# EAGLE design Dimmer_Board_Rev_0.2 (EAGLE 8.4.1)
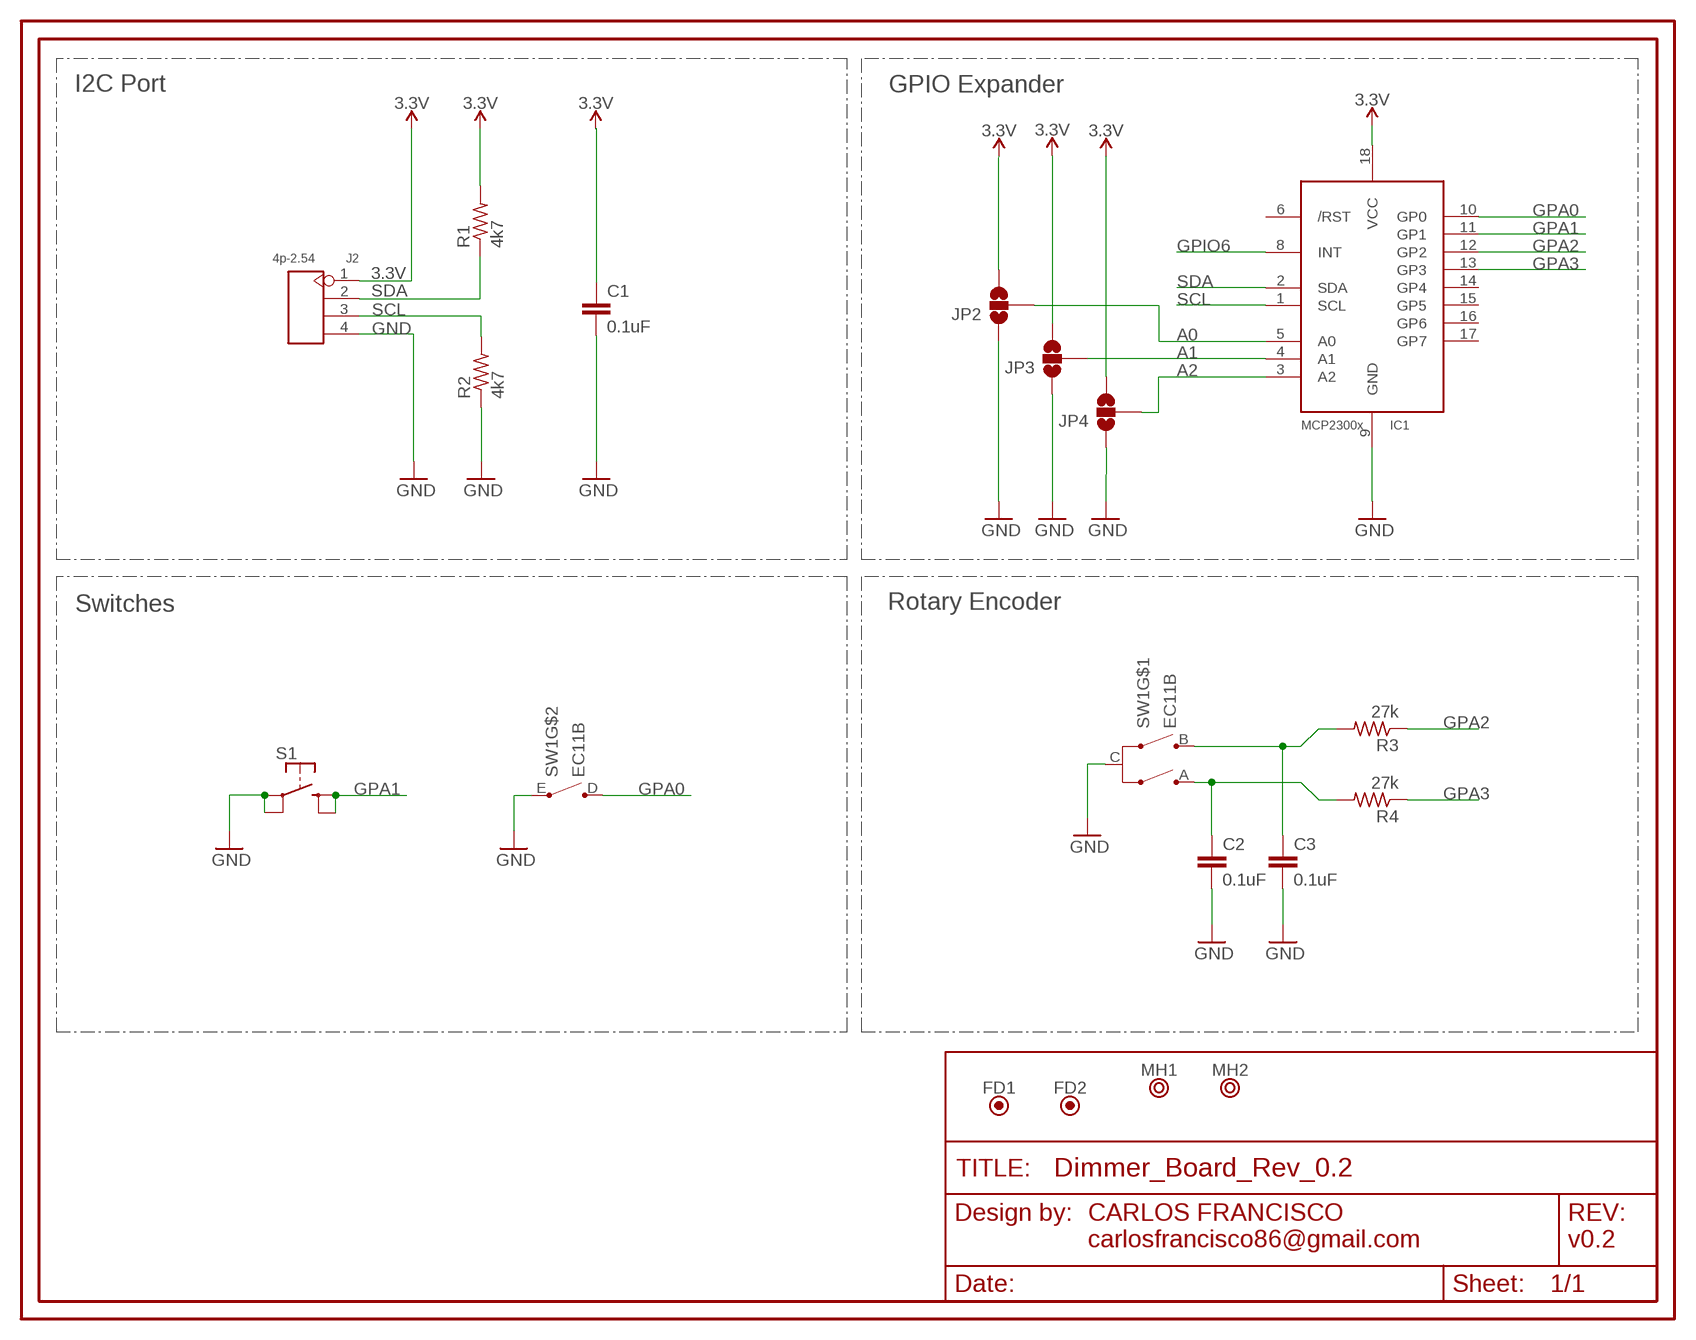
[diagram p0: schematic, sheet 1]

## Parts
C1  0.1uF  C-EUC0805  [C0805]
C2  0.1uF  C-EUC0805  [C0805]
C3  0.1uF  C-EUC0805  [C0805]
FD1  FIDUCIALBFID  [BOARD_FIDUCIAL]
FD2  FIDUCIALBFID  [BOARD_FIDUCIAL]
IC1  MCP23008/SO  [SO18W]
J2  4p-2.54  DIP-BLACK-MALE-HEADER-VERT(4P-2.54)  [H4-2.54]
JP2  JUMPER-SMT_3_NO_SILK  [SMT-JUMPER_3_NO_SILK]
JP3  JUMPER-SMT_3_NO_SILK  [SMT-JUMPER_3_NO_SILK]
JP4  JUMPER-SMT_3_NO_SILK  [SMT-JUMPER_3_NO_SILK]
MH1  MOUNTING_HOLE3.5MM  [MTGP500H350]
MH2  MOUNTING_HOLE3.5MM  [MTGP500H350]
R1  4k7  R-US_R0805  [R0805]
R2  4k7  R-US_R0805  [R0805]
R3  27k  R-US_R0805  [R0805]
R4  27k  R-US_R0805  [R0805]
S1  BUTTON-4KSC  [KSC_X]
SW1  EC11B  EC11B-V-T  [EC11B-V]

## Nets
3.3V: C1.1 IC1.18(VCC) J2.1 JP2.3 JP3.3 JP4.3 R1.2
A: C2.1 R4.2 SW1.A
A0: IC1.5(A0) JP2.2
A1: IC1.4(A1) JP3.2
A2: IC1.3(A2) JP4.2
B: C3.1 R3.2 SW1.B
GND: C1.2 C2.2 C3.2 IC1.9(GND) J2.4 JP2.1 JP3.1 JP4.1 R2.1 S1.1 S1.2 SW1.C SW1.E
GPA0: IC1.10(GP0) SW1.D
GPA1: IC1.11(GP1) S1.3 S1.4
GPA2: IC1.12(GP2) R3.1
GPA3: IC1.13(GP3) R4.1
GPIO6: IC1.8(INT)
SCL: IC1.1(SCL) J2.3 R2.2
SDA: IC1.2(SDA) J2.2 R1.1
Unconnected: IC1.6(/RST) IC1.14(GP4) IC1.15(GP5) IC1.16(GP6) IC1.17(GP7) MH1.1 MH2.1

## Notes on the sheet
- I2C Port | GPIO Expander
- Switches | Rotary Encoder
- CARLOS FRANCISCO
  carlosfrancisco86@gmail.com
- v0.2

## Library data of the parts
C1-C3 = rcl:C-EU: CAPACITOR, European symbol
FD1 FD2 = Mtronik-Aesthetics:FIDUCIAL: FIDUCIAL Symbol
IC1 = adafruit:MCP23008: MCP23008 Inexpensive i2c i/o expander - 8 general purpose i/o pins with optional pullups
J2 = Seeed-Connector:DIP-BLACK-MALE-HEADER-VERT(4P-2.54): 320020017; MPN: P125-1104A0BS116A1
JP2-JP4 = SparkFun-Jumpers:JUMPER-SMT_3_NO: Normally open jumper This jumper has three pads in close proximity to each other. Apply solder to close the connection(s).
MH1 MH2 = Mtronik-Aesthetics:MOUNTING_HOLE: MOUNTING HOLE Symbol
R1-R4 = rcl:R-US_: RESISTOR, American symbol
S1 = CoachManAir:BUTTON-4
SW1 = alps:EC11B-V-T: ALPS EC11B Vertikal mit Taster Drehimpulsgeber 11mm

## Board
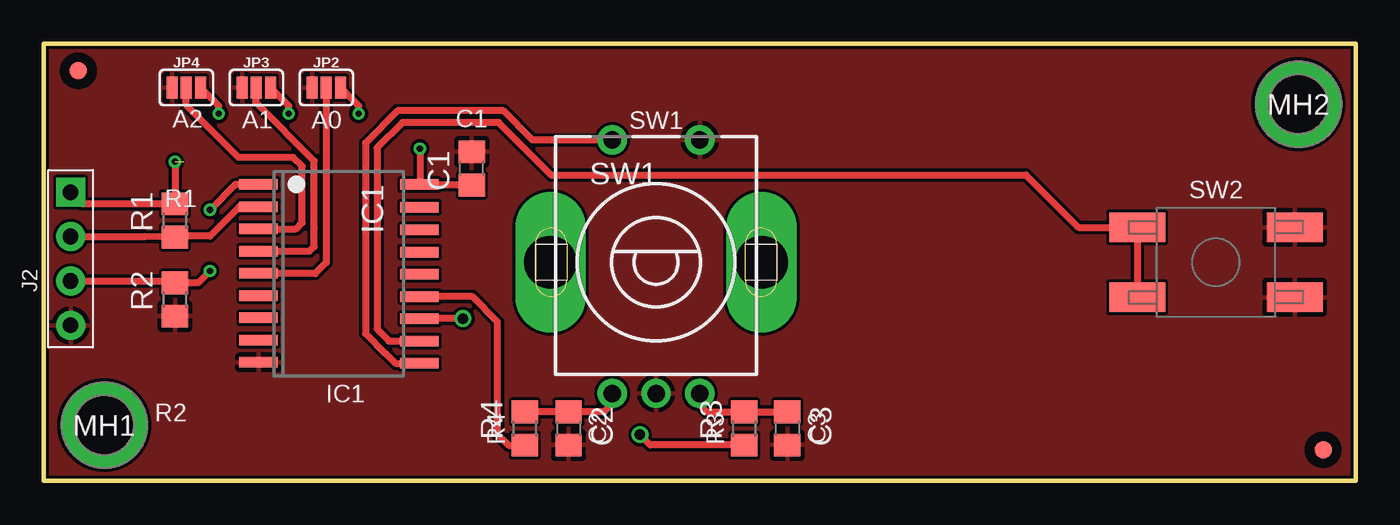
[diagram p1: board, top side]
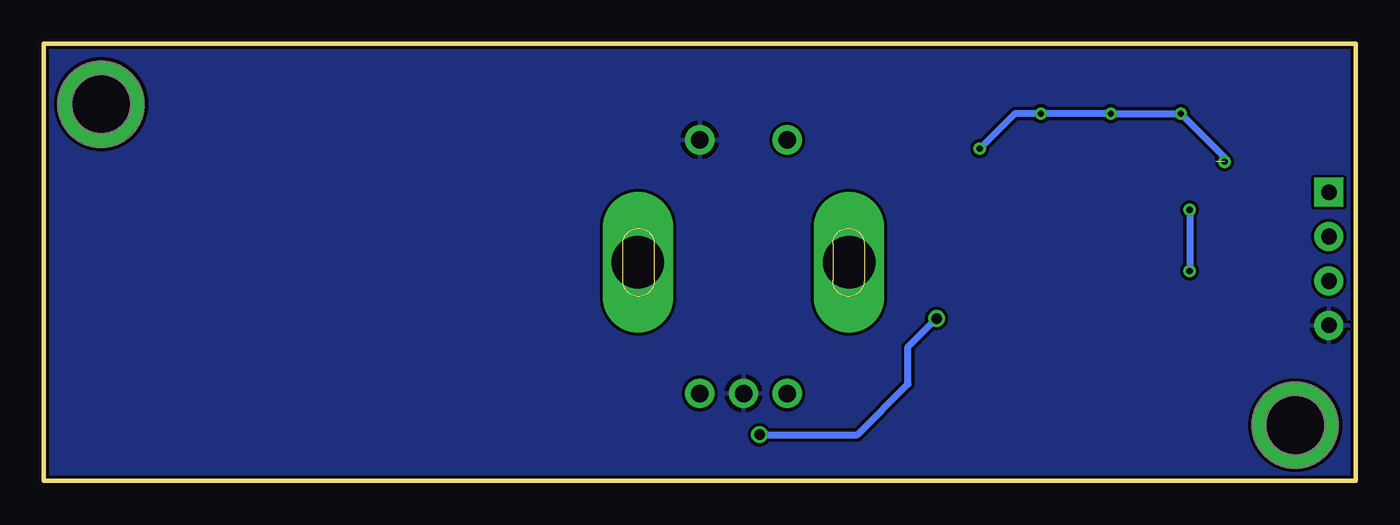
[diagram p2: board, bottom side, seen from below]

Size 75 x 25 mm. Coordinates in mm from the lower left corner, seen from the top.
Outline: 0,0 75,0 75,25 0,25 0,0
Copper layers (1*16): Top 0.035mm / dielectric 1.5mm / Bottom 0.035mm
Design rules "SparkFun-2-layer-TIGHT": minimum track width 7mil, minimum drill 15mil, track to track 7mil, track to pad 7mil, pad to pad 7mil, via to via 7mil, smd to smd 7mil, copper to edge 7mil, drill to drill 7mil, minimum pad ring 7mil, minimum via ring 7mil, stop-mask expansion 4mil, vias tented up to drill 25mil, thermal gap 10mil

### Footprints (pad centres in the part's own frame; a part is rotated, then mirrored left to right if it is on the bottom)
C0805 = smd 1.3 x 1.5: 1 -0.95,0; 2 0.95,0
BOARD_FIDUCIAL = smd 1 x 1: FID1 0,0
SO18W = smd 0.6 x 2.2: 1 -4.445,-4.6; 2 -3.175,-4.6; 3 -1.905,-4.6; 4 -0.635,-4.6; 5 0.635,-4.6; 6 1.905,-4.6; 7 3.175,-4.6; 8 4.445,-4.6; 9 5.715,-4.6; 10 5.775,4.6; 11 4.505,4.6; 12 3.235,4.6; 13 1.965,4.6; 14 0.695,4.6; 15 -0.575,4.6; 16 -1.845,4.6; 17 -3.145,4.6; 18 -4.445,4.6
H4-2.54 = drill 0.889 pad 1.651 square: 1 0,3.81 | drill 0.889 pad 1.651: 2 0,1.27; 3 0,-1.27; 4 0,-3.81
SMT-JUMPER_3_NO_SILK = smd 0.635 x 1.27: 1 -0.813,0; 2 0,0; 3 0.813,0
MTGP500H350 = drill 3.5 pad 5: 1 0,0
R0805 = smd 1.3 x 1.5: 1 -0.95,0; 2 0.95,0
KSC_X = smd 3.2 x 1.7: 1 -4.5,2; 2 -4.5,-2; 3 4.5,2; 4 4.5,-2
EC11B-V = drill 1 pad 1.676: A -2.5,-7.5; B 2.5,-7.5; C 0,-7.5; D -2.5,7; E 2.5,7 | drill 3 pad 3.3 long: G1 -6.032,0; G2 6.032,0

### Placement (x,y rotation side)
C1  24.47,17.87 90 top
C2  30,3 270 top
C3  42.5,3 270 top
FD1  73.13,1.77 0 top
FD2  1.98,23.45 0 top
IC1  16.88,12.5 270 top
J2  1.54,12.7 0 top
JP2  16.15,22.49 0 top
JP3  12.15,22.49 0 top
JP4  8.15,22.49 0 top
MH1  3.46,3.18 0 top
MH2  71.72,21.54 0 top
R1  7.5,14.89 90 top
R2  7.5,10.37 90 top
R3  40.04,3 90 top
R4  27.5,3 90 top
S1  67,12.5 180 top
SW1  35,12.5 0 top

### Tracks (layer width: path | path; a pad name or v marks a point on that pad's centre or on a via)
3.3V  (via drill 0.35)  (1 unrouted)
  Top 0.406: C1.1 24.44,16.95 IC1.18 21.5,16.96 v21.5,19 | v10,21 10,21.45 JP4.3 | v14,21 14,21.45 JP3.3 | v18,21 18,21.45 JP2.3 | J2.1 2.21,15.84 R1.2 v7.5,18.25
  Bottom 0.406: v21.5,19 19.5,21 v18,21 v14,21 v10,21 7.5,18.5 v7.5,18.25
A
  Top 0.406: SW1.A 32.5,4.41 32.04,3.95 C2.1 R4.2
A0
  Top 0.406: JP2.2 16.15,12.48 15.52,11.85 12.29,11.85 IC1.5
A1
  Top 0.406: JP3.2 12.13,22.47 12.13,21.62 15.46,18.29 15.46,14.47 | 15.46,14.47 15.46,13.4 15.2,13.13 IC1.4 | 15.46,14.47 15.45,14.48
A2
  Top 0.406: 8.13,22.47 JP4.2 8.15,21.48 11.13,18.5 14.27,18.5 14.78,17.99 14.78,14.77 14.41,14.4 IC1.3
B
  Top 0.406: SW1.B 37.5,4.33 37.88,3.95 R3.2 C3.1
GND
  pour Bottom: 75,25 0,25 0,0 75,0
  pour Top: 0,25 75,25 75,0 0,0
GPA0
  Top 0.406: SW1.D 27.93,19.5 26.27,21.16 20.23,21.16 18.39,19.32 18.39,8.42 19.52,7.29 19.54,7.29 20.11,6.72 IC1.10
GPA1
  Top 0.406: IC1.11 19.74,8 19.05,8.69 19.05,19.05 20.5,20.5 26,20.5 29,17.5 56.15,17.5 59.15,14.5 S1.4 S1.3
GPA2  (via drill 0.6)
  Top 0.406: R3.1 34.67,2.05 v34.08,2.64 | v23.96,9.28 21.5,9.28 IC1.12
  Bottom 0.406: v34.08,2.64 28.49,2.64 25.59,5.54 25.59,7.67 23.98,9.28 v23.96,9.28
GPA3
  Top 0.406: R4.1 27.98,2.03 26.57,2.03 25.93,2.67 25.93,9.1 24.5,10.53 IC1.13
GPIO6
  Top 0.406: 12.27,8.07 IC1.8
SCL  (via drill 0.35)
  Top 0.406: IC1.1 10.95,16.95 v9.5,15.5 | J2.3 7.65,11.43 R2.2 8.82,11.32 v9.5,12
  Bottom 0.406: v9.5,15.5 v9.5,12
SDA
  Top 0.406: 12.27,15.69 IC1.2 12.27,15.69 11.19,15.69 9.5,14 7.56,14 R1.1 5.74,13.97 J2.2

### Text on the board
tPlace: A2 | A1 | A0 | C1 | SW1 | SW2 | R1 | IC1 | R2 | R4 | C2 | R3 | C3